# EAGLE design CAN Module (EAGLE 6.5.0)
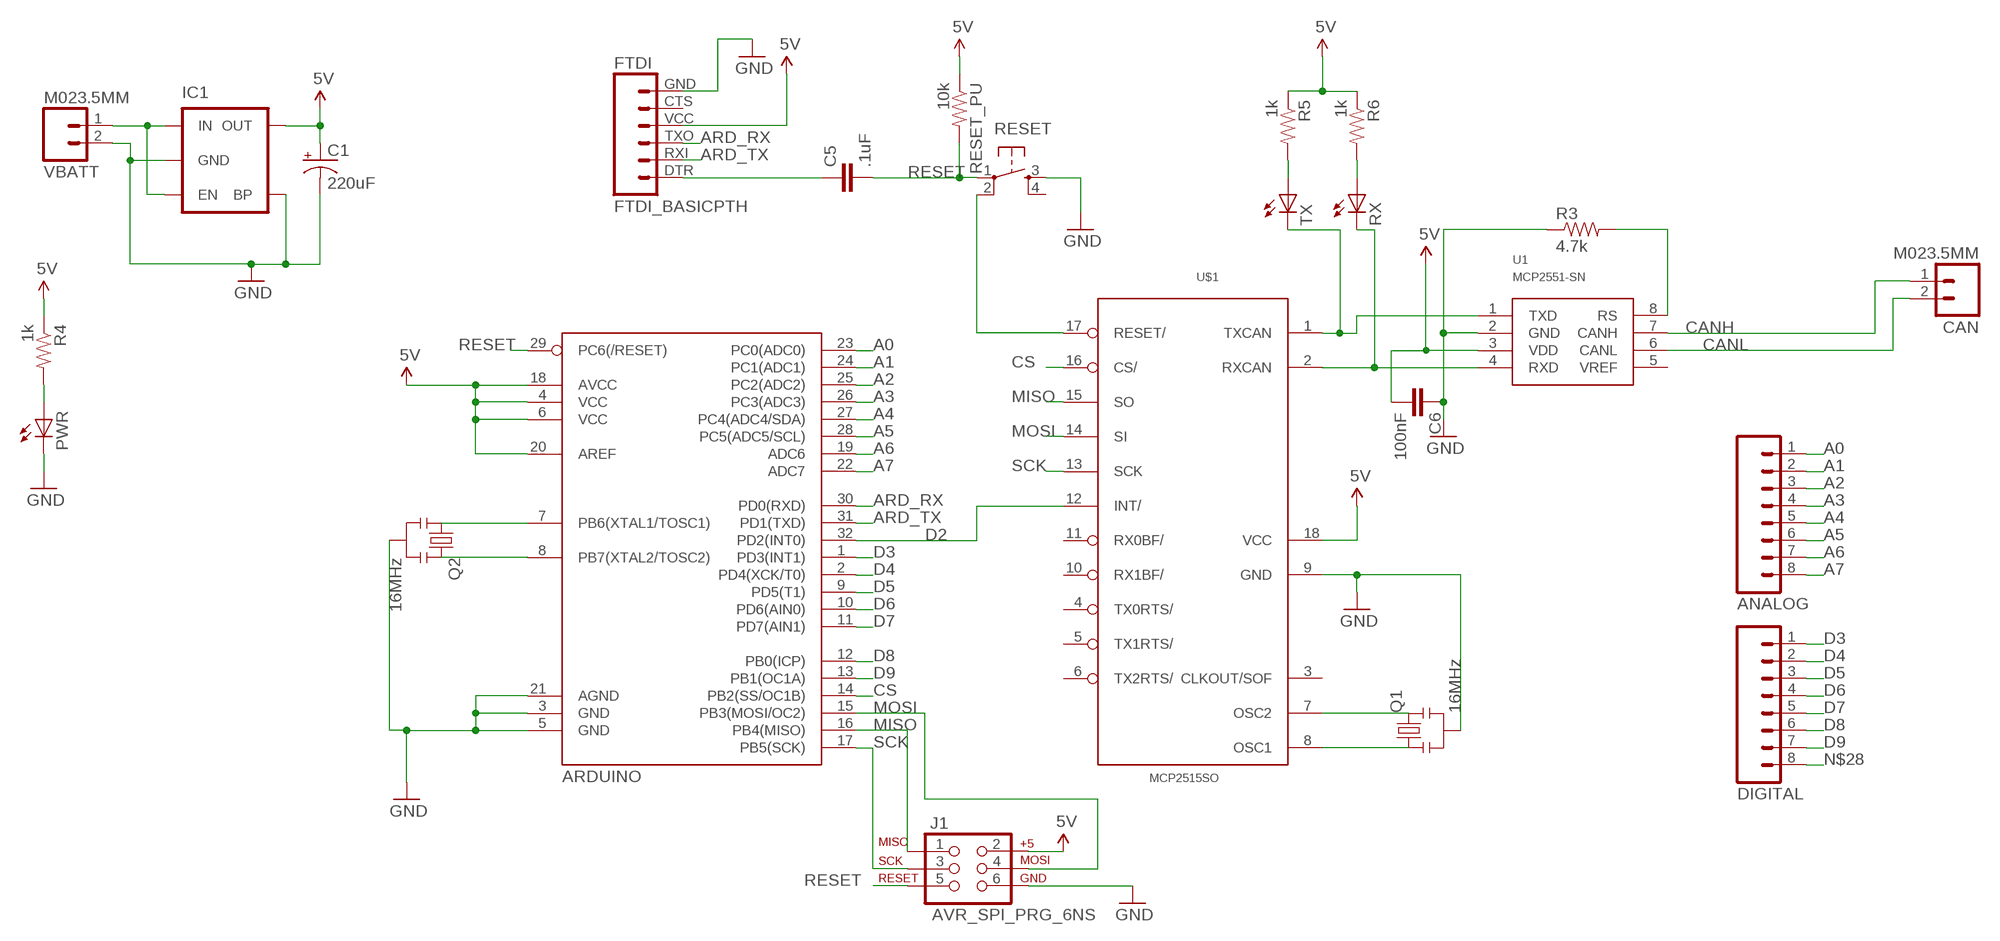
[diagram p0: schematic, sheet 1]

## Parts
ANALOG  M08LOCK  [1X08_LOCK]
ARDUINO  ATMEGA328_SMT  [TQFP32-08]
C1  220uF  CAP_POL1206-KIT  [EIA3216-KIT]
C5  .1uF  CAP0805  [0805]
C6  100nF  CAP0805  [0805]
CAN  M023.5MM  [SCREWTERMINAL-3.5MM-2]
DIGITAL  M08LOCK  [1X08_LOCK]
FTDI  FTDI_BASICPTH  [FTDI_BASIC]
IC1  MIC52055V  [SOT23-5]
J1  AVR_SPI_PRG_6NS  [2X3-NS]
PWR  LEDCHIPLED_0805  [CHIPLED_0805]
Q1  16MHz  RESONATOR16MHZ  [RESONATOR-SMD]
Q2  16MHz  RESONATOR16MHZ  [RESONATOR-SMD]
R3  4.7k  RESISTOR0805-RES  [0805]
R4  1k  RESISTOR0805-RES  [0805]
R5  1k  RESISTOR0805-RES  [0805]
R6  1k  RESISTOR0805-RES  [0805]
RESET  TAC_SWITCHSMD  [TACTILE_SWITCH_SMD]
RESET_PU  10k  RESISTOR0805-RES  [0805]
RX  LEDCHIPLED_0805  [CHIPLED_0805]
TX  LEDCHIPLED_0805  [CHIPLED_0805]
U1  MCP2551-SN  [SO-08]
U$1  MCP2515SO  [SO18L]
VBATT  M023.5MM  [SCREWTERMINAL-3.5MM-2]

## Nets
5V: ARDUINO.4(VCC) ARDUINO.6(VCC) ARDUINO.18(AVCC) ARDUINO.20(AREF) C1.A(+) C6.2 FTDI.VCC IC1.5(OUT) J1.2 R4.1 R5.1 R6.1 RESET_PU.1 U1.3(VDD) U$1.18(VCC)
A0: ANALOG.1 ARDUINO.23(PC0(ADC0))
A1: ANALOG.2 ARDUINO.24(PC1(ADC1))
A2: ANALOG.3 ARDUINO.25(PC2(ADC2))
A3: ANALOG.4 ARDUINO.26(PC3(ADC3))
A4: ANALOG.5 ARDUINO.27(PC4(ADC4/SDA))
A5: ANALOG.6 ARDUINO.28(PC5(ADC5/SCL))
A6: ANALOG.7 ARDUINO.19(ADC6)
A7: ANALOG.8 ARDUINO.22(ADC7)
ARD_RX: ARDUINO.30(PD0(RXD)) FTDI.TXO
ARD_TX: ARDUINO.31(PD1(TXD)) FTDI.RXI
CANH: CAN.1 U1.7(CANH)
CANL: CAN.2 U1.6(CANL)
CS: ARDUINO.14(PB2(SS/OC1B)) U$1.16(CS/)
D2: ARDUINO.32(PD2(INT0)) U$1.12(INT/)
D3: ARDUINO.1(PD3(INT1)) DIGITAL.1
D4: ARDUINO.2(PD4(XCK/T0)) DIGITAL.2
D5: ARDUINO.9(PD5(T1)) DIGITAL.3
D6: ARDUINO.10(PD6(AIN0)) DIGITAL.4
D7: ARDUINO.11(PD7(AIN1)) DIGITAL.5
D8: ARDUINO.12(PB0(ICP)) DIGITAL.6
D9: ARDUINO.13(PB1(OC1A)) DIGITAL.7
GND: ARDUINO.3(GND) ARDUINO.5(GND) ARDUINO.21(AGND) C1.C(-) C6.1 FTDI.GND IC1.2(GND) IC1.4(BP) J1.6 PWR.C Q1.2 Q2.2 R3.1 RESET.3 U1.2(GND) U$1.9(GND) VBATT.2
MISO: ARDUINO.16(PB4(MISO)) J1.1 U$1.15(SO)
MOSI: ARDUINO.15(PB3(MOSI/OC2)) J1.4 U$1.14(SI)
N$2: RX.C U1.4(RXD) U$1.2(RXCAN)
N$3: TX.C U1.1(TXD) U$1.1(TXCAN)
N$8: RESET.2 U$1.17(RESET/)
N$9: ARDUINO.7(PB6(XTAL1/TOSC1)) Q2.1
N$10: ARDUINO.8(PB7(XTAL2/TOSC2)) Q2.3
N$11: C5.1 FTDI.DTR
N$12: Q1.3 U$1.7(OSC2)
N$13: Q1.1 U$1.8(OSC1)
N$14: IC1.1(IN) IC1.3(EN) VBATT.1
N$15: R3.2 U1.8(RS)
N$16: PWR.A R4.2
N$17: R5.2 TX.A
N$18: R6.2 RX.A
N$28: DIGITAL.8
RESET: ARDUINO.29(PC6(/RESET)) C5.2 J1.5 RESET.1 RESET_PU.2
SCK: ARDUINO.17(PB5(SCK)) J1.3 U$1.13(SCK)
Unconnected: FTDI.CTS RESET.4 U1.5(VREF) U$1.3(CLKOUT/SOF) U$1.4(TX0RTS/) U$1.5(TX1RTS/) U$1.6(TX2RTS/) U$1.10(RX1BF/) U$1.11(RX0BF/)

## Library data of the parts
ANALOG DIGITAL = SparkFun-Connectors:M08: Header 8 Standard 8-pin 0.1" header. Use with straight break away headers (SKU : PRT-00116), right angle break away headers (PRT-00553), swiss pins (PRT-00743), machine pins (PRT-00117), and female headers (PRT-00115).
ARDUINO = SparkFun-DigitalIC:ATMEGA328_SMT: 32-Pin Atmega328 part Commonly used on Arduino compatible boards Available in QFP and QFN packages TQFP is IC-09069 QFN is non-stock; PROD_ID: IC-09069; VALUE: ATMEGA328P
C1 = SparkFun-Capacitors:CAP_POL: Capacitor Polarized These are standard SMD and PTH capacitors. Normally 10uF, 47uF, and 100uF in electrolytic and tantalum varieties. Always verify the external diameter of the through hole cap, it varies with capacity, voltage, and manufacturer. The EIA devices should be standard.
C5 C6 = SparkFun-Capacitors:CAP: Capacitor Standard 0603 ceramic capacitor, and 0.1" leaded capacitor.
CAN VBATT = SparkFun-Connectors:M02: Standard 2-pin 0.1" header. Use with - straight break away headers ( PRT-00116) - right angle break away headers (PRT-00553) - swiss pins (PRT-00743) - machine pins (PRT-00117) - female headers (PRT-00115) Molex polarized connector foot print use with: PRT-08233 with associated crimp pins and housings. 2.54_SCREWTERM for use with PRT-10571. 3.5mm Screw Terminal footprints for PRT-08084 5mm Screw Terminal footprints for use with PRT-08433
FTDI = SparkFun-Connectors:FTDI_BASIC: FTDI Basic header with labels
IC1 = SparkFun-PowerIC:MIC5205: MIC5205 150mA vreg 3.3V - VREG-00822 5V - VREG-00823; PROD_ID: VREG-00823
J1 = SparkFun-Connectors:AVR_SPI_PRG_6: AVR ISP 6 Pin This is the reduced ISP connector for AVR programming. Common on Arduino. This footprint will take up less PCB space and can be used with a 10-pin to 6-pin adapter such as SKU: BOB-08508
PWR RX TX = adafruit:LED: LED OSRAM: - CHIPLED LG R971, LG N971, LY N971, LG Q971, LY Q971, LO R971, LY R971 LH N974, LH R974 LS Q976, LO Q976, LY Q976 LO Q996 - Hyper CHIPLED LW Q18S LB Q993, LB Q99A, LB R99A - SideLED LS A670, LO A670, LY A670, LG A670, LP A670 LB A673, LV A673, LT A673, LW A673 LH A674 LY A675 LS A676, LA A676, LO A676, LY A676, LW A676 LS A679, LY A679, LG A679 - Hyper Micro SIDELED® LS Y876, LA Y876, LO Y876, LY Y876 LT Y87S - SmartLED LW L88C, LW L88S LB L89C, LB L89S, LG L890 LS L89K, LO L89K, LY L89K LS L896, LA L896, LO L896, LY L896 - TOPLED LS T670, LO T670, LY T670, LG T670, LP T670 LSG T670, LSP T670, LSY T670, LOP T670, LYG T670 LG T671, LOG T671, LSG T671 LB T673, LV T673, LT T673, LW T673 LH T674 LS T676, LA T676, LO T676, LY T676, LB T676, LH T676, LSB T676, LW T676 LB T67C, LV T67C, LT T67C, LS T67K, LO T67K, LY T67K, LW E67C LS E67B, LA E67B, LO E67B, LY E67B, LB E67C, LV E67C, LT E67C LW T67C LS T679, LY T679, LG T679 LS T770, LO T770, LY T770, LG T770, LP T770 LB T773, LV T773, LT T773, LW T773 LH T774 LS E675, LA E675, LY E675, LS T675 LS T776, LA T776, LO T776, LY T776, LB T776 LHGB T686 LT T68C, LB T68C - Hyper Mini TOPLED® LB M676 - Mini TOPLED Santana® LG M470 LS M47K, LO M47K, LY M47K Source: http://www.osram.convergy.de/
Q1 Q2 = SparkFun-FreqCtrl:RESONATOR: Resonator Small SMD resonator. Used, eg, on the Arduino Pro/ Pro Mini boards. 8MHz- XTAL-08895 16MHz- XTAL-08900; PROD_ID: XTAL-08900
R3-R6 RESET_PU = SparkFun-Resistors:RESISTOR: Resistor Basic schematic elements and footprints for 0603, 1206, and PTH resistors.
RESET = SparkFun-Electromechanical:TAC_SWITCH: Momentary Switch Button commonly used for reset or general input. Spark Fun Electronics SKU : COM-00097 SMT- SWCH-08247; PROD_ID: SWCH-08247
U1 = MCP2551:MCP2551: Maciej Kalinowski maciek@chwarzno.pl
U$1 = MCP2515_MT:MCP2515*: MCP2515 Standalone CAN-Controller by Microchip Eagle-Lib. by MartinThomas

## Net classes
0 default: clearance 0.205 mm

## Board
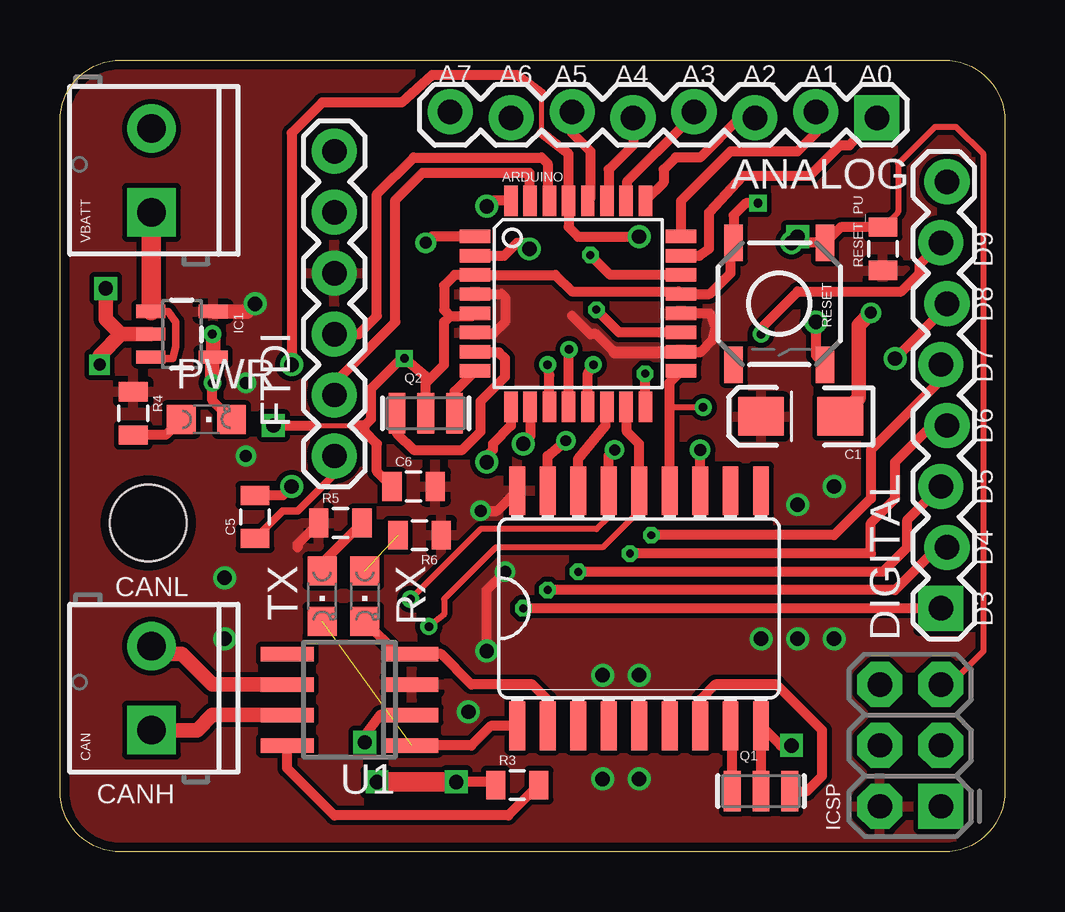
[diagram p1: board, top side]
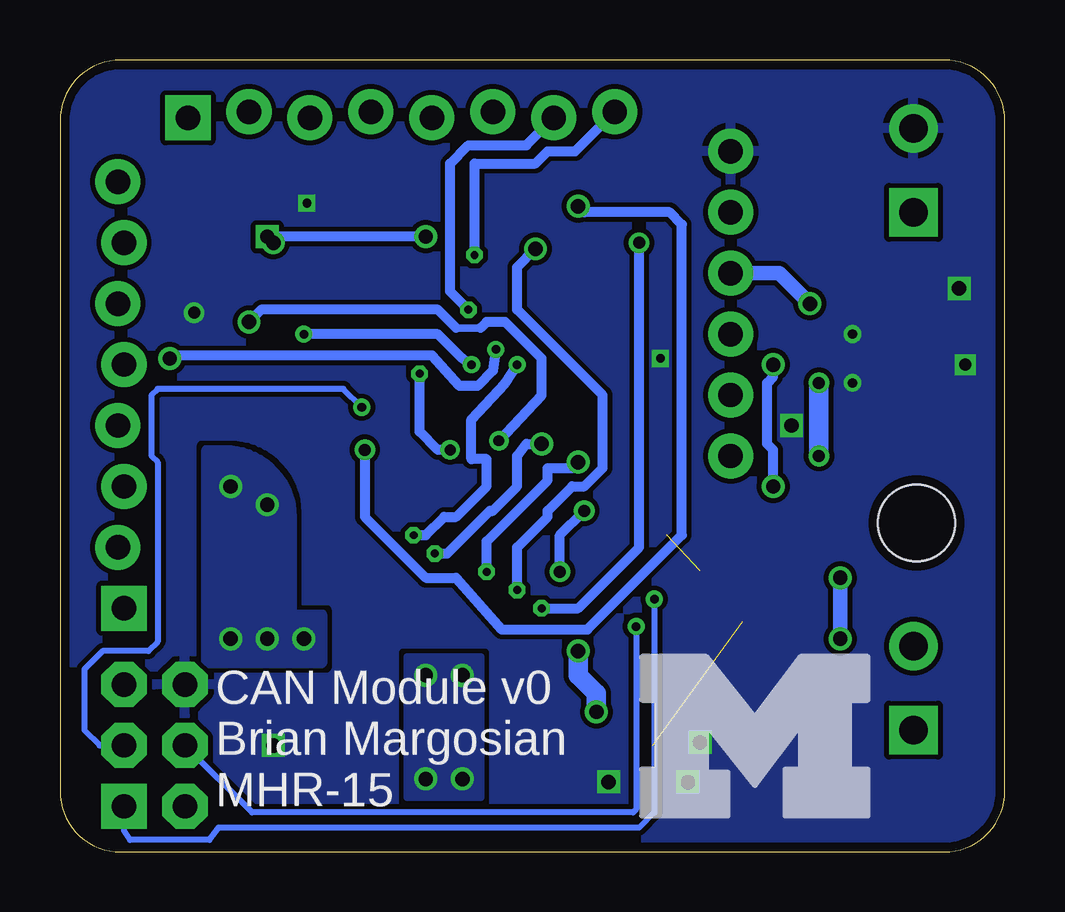
[diagram p2: board, bottom side, seen from below]

Size 39.37 x 33.02 mm. Coordinates in mm from the lower left corner, seen from the top.
Outline: 39.37,30.48 39.37,2.54 arc-90 36.83,0 2.54,0 arc-90 0,2.54 0,30.48 arc-90 2.54,33.02 36.83,33.02 arc-90 39.37,30.48
Copper layers (1*16): Top 0.0356mm / dielectric 1.5011mm / Bottom 0.0356mm
Design rules "OshPark2014 *": minimum track width 6mil, minimum drill 13mil, track to track 6mil, track to pad 6mil, pad to pad 6mil, via to via 6mil, smd to smd 6mil, copper to edge 15mil, drill to drill 6mil, minimum pad ring 7mil, minimum via ring 7mil, stop-mask expansion 3mil, vias tented up to drill 0mil, thermal gap 10mil
Holes 3.2 mm at 3.68,13.72

### Footprints (pad centres in the part's own frame; a part is rotated, then mirrored left to right if it is on the bottom)
1X08_LOCK = drill 1.016 pad 1.88 square: 1 0,0.127 | drill 1.016 pad 1.88: 2 2.54,-0.127; 3 5.08,0.127; 4 7.62,-0.127; 5 10.16,0.127; 6 12.7,-0.127; 7 15.24,0.127; 8 17.78,-0.127
TQFP32-08 = smd 1.27 x 0.559: 1 -4.293,2.8; 2 -4.293,2; 3 -4.293,1.2; 4 -4.293,0.4; 5 -4.293,-0.4; 6 -4.293,-1.2; 7 -4.293,-2; 8 -4.293,-2.8; 17 4.293,-2.8; 18 4.293,-2; 19 4.293,-1.2; 20 4.293,-0.4; 21 4.293,0.4; 22 4.293,1.2; 23 4.293,2; 24 4.293,2.8 | smd 0.559 x 1.27: 9 -2.8,-4.293; 10 -2,-4.293; 11 -1.2,-4.293; 12 -0.4,-4.293; 13 0.4,-4.293; 14 1.2,-4.293; 15 2,-4.293; 16 2.8,-4.293; 25 2.8,4.293; 26 2,4.293; 27 1.2,4.293; 28 0.4,4.293; 29 -0.4,4.293; 30 -1.2,4.293; 31 -2,4.293; 32 -2.8,4.293
EIA3216-KIT = smd 1.9 x 1.6: A 1.65,0; C -1.65,0
0805 = smd 0.8 x 1.2: 1 -0.9,0; 2 0.9,0
SCREWTERMINAL-3.5MM-2 = drill 1.2 pad 2.032 square: 1 0,0 | drill 1.2 pad 2.032: 2 3.5,0
FTDI_BASIC = drill 1.016 pad 1.88: CTS 10.16,0; DTR 0,0; GND 12.7,0; RXI 2.54,0; TXO 5.08,0; VCC 7.62,0
SOT23-5 = smd 0.55 x 1.2: 1 -0.95,-1.3; 2 0,-1.3; 3 0.95,-1.3; 4 0.95,1.3; 5 -0.95,1.3
2X3-NS = drill 1.016 pad 1.88 square: 1 -2.54,-1.27 | drill 1.016 pad 1.88 octagon: 2 -2.54,1.27; 3 0,-1.27; 4 0,1.27; 5 2.54,-1.27; 6 2.54,1.27
CHIPLED_0805 = smd 1.2 x 1.2: A 0,-1.05; C 0,1.05
RESONATOR-SMD = smd 0.7 x 1.7: 1 -1.2,0; 2 0,0; 3 1.2,0
TACTILE_SWITCH_SMD = smd 1.524 x 0.762: 1 -2.54,1.905; 2 2.54,1.905; 3 -2.54,-1.905; 4 2.54,-1.905
SO-08 = smd 0.6 x 2.2: 1 -1.905,-2.6; 2 -0.635,-2.6; 3 0.635,-2.6; 4 1.905,-2.6; 5 1.905,2.6; 6 0.635,2.6; 7 -0.635,2.6; 8 -1.905,2.6
SO18L = smd 0.66 x 2.032: 1 -5.08,-4.902; 2 -3.81,-4.902; 3 -2.54,-4.902; 4 -1.27,-4.902; 5 0,-4.902; 6 1.27,-4.902; 7 2.54,-4.902; 8 3.81,-4.902; 9 5.08,-4.902; 10 5.08,4.902; 11 3.81,4.902; 12 2.54,4.902; 13 1.27,4.902; 14 0,4.902; 15 -1.27,4.902; 16 -2.54,4.902; 17 -3.81,4.902; 18 -5.08,4.902

### Placement (x,y rotation side)
ANALOG  34.04,30.73 180 top
ARDUINO  21.59,22.86 0 top
C1  30.86,18.16 180 top
C5  8.13,13.97 90 top
C6  14.73,15.24 0 top
CAN  3.81,5.08 90 top
DIGITAL  36.83,10.16 90 top
FTDI  11.43,16.51 90 top
IC1  5.08,21.59 270 top
J1  35.43,4.45 90 top
PWR  6.1,18.03 270 top
Q1  29.21,2.54 0 top
Q2  15.24,18.29 0 top
R3  19.05,2.79 0 top
R4  3.05,18.29 270 top
R5  11.68,13.72 0 top
R6  14.99,13.21 180 top
RESET  29.97,22.86 270 top
RESET_PU  34.29,25.15 90 top
RX  12.7,10.67 180 top
TX  10.92,10.67 180 top
U1  12.06,6.35 90 top
U$1  24.13,10.16 0 top
VBATT  3.81,26.67 90 top

### Tracks (layer width: path | path; a pad name or v marks a point on that pad's centre or on a via)
5V  (via drill 0.5, 0.6)
  Top 0.406: ARDUINO.4 18.4,23.26 18.54,23.11 18.54,22.1 18.03,21.59 17.37,21.59 ARDUINO.6 | ARDUINO.20 27.07,22.46 27.3,21.84 27.18,21.34 26.67,20.83 25.91,20.83 ARDUINO.18 25.43,20.86 25.4,20.83 25.65,20.83 | 23.11,20.83 22.35,21.59 22.1,21.59 21.34,22.35 | v17.78,8.38 17.78,10.92 v18.54,11.68 | v17.53,14.22 18.21,14.22 U$1.18 | R5.1 9.91,12.84 9.91,12.7
  Top 0.508: 25.4,20.83 23.11,20.83
  Top 0.61: IC1.5 7.81,22.54 v8.13,22.86
  Bottom 0.406: v18.54,11.68 18.54,13.21 v17.53,14.22
  Bottom 0.61: FTDI.VCC 9.4,24.13 v8.13,22.86 | v6.86,11.43 v6.86,8.89
  Bottom 0.813: v17.02,5.84 17.02,6.6 17.78,7.37 v17.78,8.38 | v7.75,19.56 v7.75,16.51
  other vias: 30.73,14.48 32.26,15.24 32.26,8.89 30.73,8.89 29.21,8.89 22.61,7.37 24.13,7.37 22.61,3.05 24.13,3.05
  pour Top: 0,33.02 39.37,33.02 39.37,0 0,0
  pour Bottom: 28.45,7.87 33.27,7.87 33.27,16.76 32.51,16.76 arc90 29.72,13.97 29.72,9.91 28.45,9.91
  pour Bottom: 21.84,8.13 24.89,8.13 24.89,2.29 21.84,2.29
A0
  Top 0.406: ARDUINO.23 26.64,24.86 27.05,25.15 27.05,26.67 28.45,28.19 31.24,28.19 32.51,29.46 32.89,29.46 ANALOG.1
A1
  Top 0.406: ARDUINO.24 25.88,27.15 27.94,29.21 30.73,29.21 31.5,29.97 ANALOG.2
A2
  Top 0.406: ANALOG.3 28.32,30.61 26.67,28.96 25.65,28.96 25.15,28.45 25.15,27.91 ARDUINO.25
A3
  Top 0.406: ANALOG.4 26.04,30.35 23.62,27.94 23.62,27.18 ARDUINO.26
A4
  Top 0.406: ANALOG.5 23.88,29.46 22.86,28.45 22.86,27.22 ARDUINO.27
A5
  Top 0.406: ANALOG.6 21.34,29.97 22.1,29.21 22.1,27.26 ARDUINO.28
A6  (via drill 0.33)
  Top 0.406: ARDUINO.19 23.3,21.66 v22.35,22.61
  Bottom 0.406: ANALOG.7 19.94,29.46 22.35,29.46 23.11,28.7 23.11,23.37 v22.35,22.61
A7  (via drill 0.33)
  Top 0.406: ARDUINO.22 22.93,24.06 v22.1,24.89
  Bottom 0.406: v22.1,24.89 22.1,28.7 19.56,28.7 19.05,29.21 17.91,29.21 ANALOG.8
ARD_RX
  Top 0.406: FTDI.TXO 12.45,21.59 13.21,22.35 13.21,27.43 14.73,28.96 20.07,28.96 20.32,28.7 20.32,27.22 ARDUINO.30
ARD_TX
  Top 0.406: FTDI.RXI 11.43,19.56 13.97,22.1 13.97,27.18 15.11,28.32 19.56,28.32 19.56,27.18 ARDUINO.31
CANH
  Top 0.61: U1.7 6.35,5.71 5.71,5.08 CAN.1
CANL
  Top 0.61: U1.6 6.35,6.99 5.08,8.26 4.13,8.26 CAN.2
CS
  Top 0.406: U$1.16 21.59,16.38 22.73,17.78 22.73,18.62 ARDUINO.14
D2  (via drill 0.5, 0.6)
  Top 0.406: ARDUINO.32 18.01,27.15 v17.78,26.92 | U$1.12 v26.67,16.76
  Bottom 0.406: v26.67,16.76 26.67,13.97 24.13,11.43 22.86,11.43 20.95,9.27 17.4,9.27 13.46,13.21 13.46,26.16 13.97,26.67 17.53,26.67 v17.78,26.92
D3  (via drill 0.33, 0.5)
  Top 0.406: DIGITAL.1 v19.3,10.16 | ARDUINO.1 15.5,25.66 v15.24,25.4
  Bottom 0.406: v19.3,10.16 17.78,10.16 15.24,12.7 v15.24,25.4
D4  (via drill 0.33, 0.6)
  Top 0.406: ARDUINO.2 18.51,24.86 19.05,25.4 19.3,25.4 v19.56,25.15 | DIGITAL.2 36.58,12.7 34.8,10.92 v20.32,10.92
  Bottom 0.406: v20.32,10.92 20.32,12.7 19.05,13.97 19.05,14.22 18.03,15.24 17.53,15.24 16.76,16 16.76,19.05 20.32,22.61 20.32,24.38 v19.56,25.15
D5  (via drill 0.33, 0.6)
  Top 0.406: 36.7,15.11 DIGITAL.3 35.31,13.84 35.31,12.7 34.29,11.68 v21.59,11.68 | ARDUINO.9 18.79,17.77 18.03,17.02 18.03,16.76 17.78,16.51 v17.78,16.26
  Bottom 0.406: v21.59,11.68 21.59,12.95 19.05,15.49 19.05,16 18.03,16 v17.78,16.26
D6  (via drill 0.33, 0.6)
  Top 0.406: DIGITAL.4 36.32,17.78 34.8,16.26 34.8,14.73 33.78,13.72 33.78,12.45 v23.75,12.45 | ARDUINO.10 19.59,17.3 v19.3,17.02
  Bottom 0.406: v19.3,17.02 19.94,17.02 20.32,16.51 20.32,15.24 21.34,14.22 21.46,14.22 23.24,12.45 v23.75,12.45
D7  (via drill 0.33, 0.36)
  Top 0.406: DIGITAL.5 36.7,19.68 33.78,16.76 33.78,14.73 32.26,13.21 v24.64,13.21 | ARDUINO.11 20.39,19.88 v20.32,20.32
  Bottom 0.406: v24.64,13.21 24.13,13.21 23.37,13.97 22.86,13.97 21.59,15.24 21.59,16.38 22.23,16.38 22.23,18.03 20.83,19.56 v20.32,20.32
D8  (via drill 0.36, 0.6)
  Top 0.406: DIGITAL.6 36.96,22.73 v34.8,20.57 | ARDUINO.12 21.19,20.94 v21.21,20.95
  Bottom 0.406: v21.21,20.95 21.34,20.07 21.97,19.43 22.73,19.43 23.88,20.7 34.54,20.7 v34.8,20.57
D9  (via drill 0.36)
  Top 0.406: ARDUINO.13 21.99,19.96 v22.23,20.32 | v29.21,21.59 29.21,21.84 30.73,23.37 35.05,23.37 35.81,24.13 35.81,24.51 DIGITAL.7
  Bottom 0.406: v22.23,20.32 22.61,20.57 23.62,21.59 v29.21,21.59
GND  (via drill 0.36, 0.38, 0.5, 0.6)
  Top 0.203: 10.67,17.78 12.19,17.78
  Top 0.406: U1.2 13.34,5.71 12.57,4.7 v12.7,4.57 | Q1.2 U$1.9 30.02,4.45 v30.48,4.45 | Q2.2 15.24,19.56 | 15.24,19.56 16,20.32 16,22.1 16.26,22.35 | 16.26,22.35 17.19,22.35 ARDUINO.5 | 15.24,19.56 15.24,19.81 v14.35,20.57 14.22,20.57 12.95,19.3 12.95,18.03 12.7,17.78 | 16.26,22.35 16,22.61 16,23.62 16.44,24.06 ARDUINO.3 20.64,24.06 21.34,23.37 25.77,23.37 ARDUINO.21 27.07,23.26 27.94,24.13 27.94,25.27 RESET.3 28.07,26.54 28.57,27.05 v29.08,27.05 | v8.89,17.78 10.67,17.78 | 12.7,17.78 12.19,17.78 | R3.1 18.02,2.92 v16.51,2.92 | C6.1 13.21,15.86 13.21,17.02 12.7,17.53 12.7,17.78 | PWR.C 6.35,18.83 v6.35,19.56
  Top 0.61: IC1.2 2.54,21.59 | 2.54,21.59 1.91,22.23 v1.91,23.5 | v33.78,22.48 33.27,21.97 33.27,18.92 C1.C | v1.65,20.32 1.65,20.7 2.54,21.59 | v6.35,19.56 6.35,20.64 IC1.4 6.38,21.56 v6.35,21.59
  Top 0.813: v13.21,2.92 v16.51,2.92
  pour Bottom (rank 3): 0,33.02 39.37,33.02 39.37,0 0,0
MISO  (via drill 0.33, 0.36, 0.46)
  Top 0.254: U$1.15 22.86,13.97 22.35,13.46 17.53,13.46 v14.61,10.54
  Top 0.406: ARDUINO.16 24.39,19.81 v24.38,19.94 | U$1.15 22.86,16.51 v23.11,16.76
  Bottom 0.254: v14.61,10.54 14.61,1.65 15.24,1.02 32.77,1.02 33.15,0.51 36.45,0.51 36.7,0.89 J1.1
  Bottom 0.406: v23.11,16.76 23.62,16.76 24.38,17.53 v24.38,19.94
MOSI  (via drill 0.36)
  Top 0.254: U$1.14 24.13,14.22 22.61,12.7 18.16,12.7 16,10.54 16,9.91 v15.37,9.4
  Top 0.406: U$1.14 24.13,17.02 23.62,17.53 23.62,18.54 ARDUINO.15
  Bottom 0.254: v15.37,9.4 15.37,1.78 15.49,1.65 31.37,1.65 J1.4
N$2
  Top 0.406: U$1.2 20.32,6.35 19.68,6.99 17.14,6.99 15.88,8.26 U1.4 14.06,8.26 RX.C
N$3  (1 unrouted)
  Top 0.406: U$1.1 17.96,5.26 17.14,4.45 U1.1
N$5  (via drill 0.6)
  other vias: 30.73,25.65
N$8  (via drill 0.46, 0.6)
  Top 0.406: 31.75,20.32 RESET.2 31.5,20.7 v31.5,22.1 | U$1.17 20.32,16.51 v21.08,17.14
  Bottom 0.305: 21.84,21.84 22.86,21.84
  Bottom 0.406: v21.08,17.14 19.3,19.05 19.3,20.57 20.83,22.1 21.59,22.1 21.84,21.84 | 22.86,21.84 23.62,22.61 30.99,22.61 v31.5,22.1
N$9
  Top 0.406: Q2.1 14.04,17.46 14.73,16.76 16.76,16.76 17.53,17.53 17.53,18.8 18.54,19.81 18.54,20.57 18.29,20.83 17.33,20.83 ARDUINO.7
N$10
  Top 0.406: Q2.3 16.44,19.2 ARDUINO.8
N$11
  Top 0.305: C5.1 9.28,14.22 9.91,14.22 11.43,15.75 FTDI.DTR
N$12
  Top 0.406: Q1.3 31.11,2.54 31.75,3.17 31.75,5.08 29.84,6.99 27.3,6.99 26.67,6.35 U$1.7
N$13
  Top 0.406: Q1.1 28.01,5.19 U$1.8
N$14
  Top 0.305: IC1.1 4.51,22.54 4.83,22.1 4.83,21.08 4.7,20.57 3.85,20.57 IC1.3
  Top 0.61: 3.81,22.57 IC1.1
  Top 0.813: VBATT.1 3.81,22.57
N$15
  Top 0.406: R3.2 18.68,1.52 11.43,1.52 9.46,3.49 U1.8
N$16
  Top 0.406: PWR.A 4.4,17.39 R4.2
N$17
  Top 0.406: R5.2 10.92,12.05 TX.A
N$18  (1 unrouted)
RESET  (via drill 0.6)
  Top 0.203: 20.07,29.97 20.07,31.62
  Top 0.254: J1.5 37.08,6.99 38.48,8.38 38.48,29.08 37.34,30.23 36.45,30.23 34.92,28.7 34.92,26.68 RESET_PU.2
  Top 0.406: RESET_PU.2 32.52,26.05 RESET.1 v30.48,25.4 | v24.13,25.65 21.59,25.65 21.19,26.05 ARDUINO.29 21.19,29.1 20.07,29.97 | 20.07,31.62 19.05,32.38 15.49,32.38 14.22,31.24 10.92,31.24 9.65,29.97 v9.65,20.32 | v9.65,15.24 9.28,14.87 C5.2
  Bottom 0.406: v24.13,25.65 30.23,25.65 v30.48,25.4 | v9.65,15.24 9.65,16.76 9.91,17.02 9.91,19.56 9.65,19.81 v9.65,20.32
SCK  (via drill 0.36)
  Top 0.254: 25.4,18.54 v26.8,18.54
  Top 0.406: U$1.13 25.4,18.54 25.4,19.58 ARDUINO.17
  Bottom 0.254: v26.8,18.54 27.56,19.3 35.31,19.3 35.56,19.05 35.56,16.51 35.31,16.26 35.31,8.76 35.69,8.38 37.59,8.38 38.35,7.62 38.35,5.08 37.72,4.45 J1.3

### Text on the board
bPlace: CAN Module v0 / Brian Margosian / MHR-15
tNames: A7 | A6 | A5 | A4 | A3 | A2 | A1 | A0 | D9 | D8 | D7 | D6 | D5 | D4 | CANL | D3 | CANH | ICSP